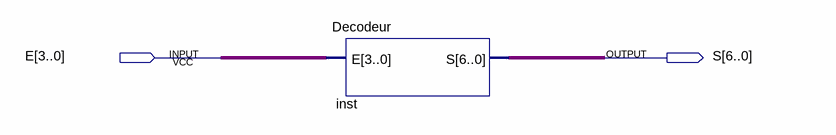
[diagram p0: schematic sheet]
// Quartus schematic Decodeur_SCHEME.bdf as structural Verilog: 1 symbols, 2 pins
module Decodeur_SCHEME (
  input  [3:0] E,
  output [6:0] S
);

  Decodeur inst (.E(E), .S(S));
endmodule
